# Altium schematic sheet AMS_MCU.SchDoc: MCU
size A4; CheckedBy: Àlex Sánchez i Benet; DrawnBy: Àlex Sánchez i Benet; DocumentNumber: 1; Revision: 1; SheetNumber: 1; SheetTotal: 4; University: UPC EEBE; City: Barcelona; Country: Spain; CP: 08019; Address: Av. Eduard Maristany, 16
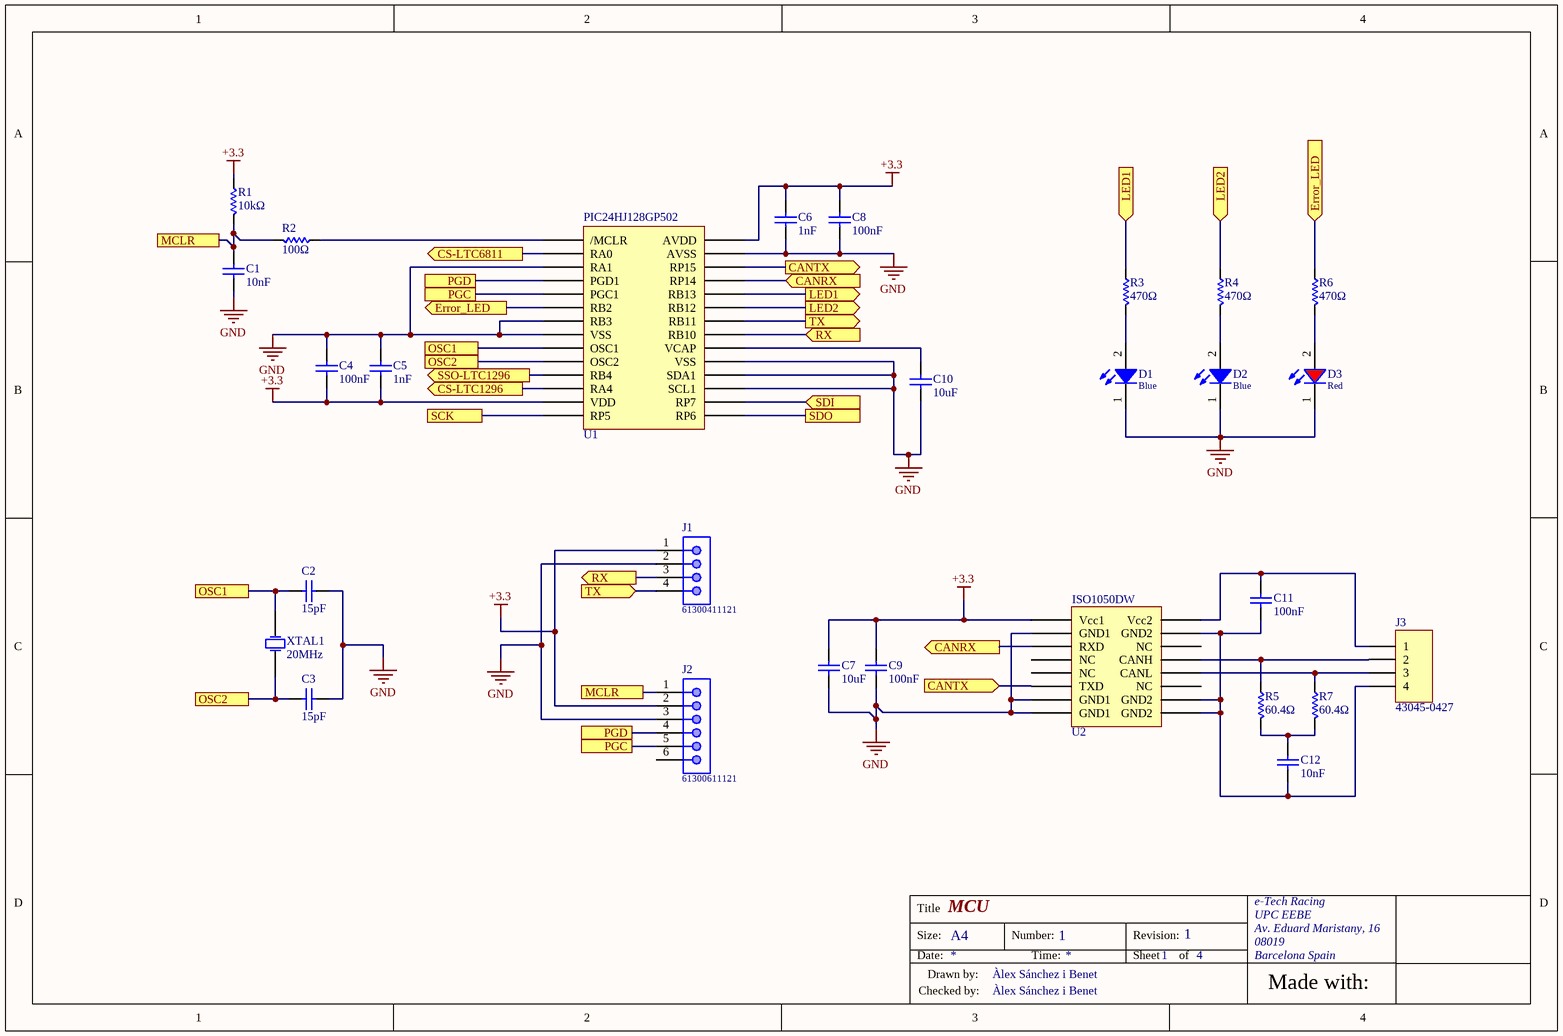
[diagram p0: AMS_MCU.SchDoc]

## Parts
C1  10nF  [0805_2x1.25x0.8mm_Reflow Soldering]
C2  15pF  [0805_2x1.25x0.6mm_Reflow Soldering]
C3  15pF  [0805_2x1.25x0.6mm_Reflow Soldering]
C4  100nF  [0805_2x1.25x0.8mm_Reflow Soldering]
C5  1nF  [0805_2x1.25x0.8mm_Reflow Soldering]
C6  1nF  [0805_2x1.25x0.8mm_Reflow Soldering]
C7  10uF  [0805_2x1.25x1.25mm_Reflow Soldering]
C8  100nF  [0805_2x1.25x0.8mm_Reflow Soldering]
C9  100nF  [0805_2x1.25x0.8mm_Reflow Soldering]
C10  10uF  [0805_2x1.25x1.25mm_Reflow Soldering]
C11  100nF  [0805_2x1.25x0.8mm_Reflow Soldering]
C12  10nF  [0805_2x1.25x0.8mm_Reflow Soldering]
D1  Blue  [WL-SMCW_0805]
D2  Blue  [WL-SMCW_0805]
D3  Red  [WL-SMCW_0805]
J1  61300411121  [61300411121]
J2  61300611121  [61300611121]
J3  43045-0427  [43045-0427]
R1  10kΩ  [CR0805]
R2  100Ω  [CR0805]
R3  470Ω  [CR0805]
R4  470Ω  [CR0805]
R5  60.4Ω  [CR0805]
R6  470Ω  [CR0805]
R7  60.4Ω  [CR0805]
U1  PIC24HJ128GP502  [PIC24HJ128GP502]
U2  ISO1050DW  [ISO1050DW]
XTAL1  20MHz  [830028710]

## Ports
CANRX (in), CANRX (out), CANTX (in), CANTX (out), CS-LTC1296 (out), CS-LTC6811 (out), Error_LED (in), Error_LED (out), LED1 (in), LED1 (out), LED2 (in), LED2 (out), MCLR, OSC1, OSC2, PGC, PGD, RX (in), RX (out), SCK, SDI (in), SDO, SSO-LTC1296 (out), TX (in), TX (out)

## Nets
+3.3: C4.1 C5.1 C6.2 C7.2 C8.2 C9.2 J1.1 J2.2 R1.2 U1.13(VDD) U1.28(AVDD) U2.1(Vcc1)
GND: C1.1 C2.2 C3.2 C4.2 C5.2 C6.1 C7.1 C8.1 C9.1 C10.1 D1.1(K) D2.1(K) D3.1(K) J1.2 J2.3 U1.3(RA1) U1.7(RB3) U1.8(VSS) U1.17(SCL1) U1.18(SDA1) U1.19(VSS) U1.27(AVSS) U2.2(GND1) U2.7(GND1) U2.8(GND1)
CANRX: U1.25(RP14) U2.3(RXD) ; port CANRX
CANTX: U1.26(RP15) U2.6(TXD) ; port CANTX
CS-LTC1296: U1.12(RA4) ; port CS-LTC1296
CS-LTC6811: U1.2(RA0) ; port CS-LTC6811
Error_LED: R6.2 U1.6(RB2) ; port Error_LED
LED1: R3.2 U1.24(RB13) ; port LED1
LED2: R4.2 U1.23(RB12) ; port LED2
MCLR: C1.2 J2.1 R1.1 R2.1 ; port MCLR
OSC1: C2.1 U1.9(OSC1) XTAL1.2(OSC2) ; port OSC1
OSC2: C3.1 U1.10(OSC2) XTAL1.1(OSC1) ; port OSC2
PGC: J2.5 U1.5(PGC1) ; port PGC
PGD: J2.4 U1.4(PGD1) ; port PGD
RX: J1.3 U1.21(RB10) ; port RX
SCK: U1.14(RP5) ; port SCK
SDI: U1.16(RP7) ; port SDI
SDO: U1.15(RP6) ; port SDO
SSO-LTC1296: U1.11(RB4) ; port SSO-LTC1296
TX: J1.4 U1.22(RB11) ; port TX
NetC10_2: C10.2 U1.20(VCAP)
NetC11_1: C11.1 C12.1 J3.4 U2.9(GND2) U2.10(GND2) U2.15(GND2)
NetC11_2: C11.2 J3.1 U2.16(Vcc2)
NetC12_2: C12.2 R5.1 R7.1
NetD1_2: D1.2(A) R3.1
NetD2_2: D2.2(A) R4.1
NetD3_2: D3.2(A) R6.1
NetJ3_2: J3.2 R5.2 U2.13(CANH)
NetJ3_3: J3.3 R7.2 U2.12(CANL)
NetR2_2: R2.2 U1.1(/MCLR)

Not connected (* = marked no-connect by the designer): J2 6; U2 4(NC) 5(NC) 11(NC) 14(NC)

## Notes on the sheet
- Title
- e-Tech Racing
- UPC EEBE
- Size:
- Date:
- Drawn by:
- A4
- Number:
- Time:
- Revision:
- Sheet
- of
- Av. Eduard Maristany, 16
- 08019
- Barcelona Spain
- Made with:
- Checked by:

## Library data of the parts
C1 C12 = 885012207092: WCAP-CSGP Ceramic Capacitors, 0805, X7R, 50V, 10nF; Rated Voltage: 50V DC; ComponentLink1Description: Manufacturer; ComponentLink1URL: http://www.we-online.de; ComponentLink2Description: Datasheet; ComponentLink2URL: http://katalog.we-online.de/pbs/datasheet/885012207092.pdf; Part Number: 885012207092; Publisher: Wurth Elektronik; Size: 0805; Operating Temperature: -55 °C to +125 °C; Value: 10nF; Ceramic Type: X7R
C2 C3 = 885012007052: WCAP-CSGP Ceramic Capacitors, 0805, NP0, 50V, 15pF; Rated Voltage: 50V DC; ComponentLink1Description: Manufacturer; ComponentLink1URL: http://www.we-online.de; ComponentLink2Description: Datasheet; ComponentLink2URL: http://katalog.we-online.de/pbs/datasheet/885012007052.pdf; Part Number: 885012007052; Published Date: Oct. 2017; Publisher: Wurth Elektronik; Size: 0805; Operating Temperature: -55 °C to +125 °C; Value: 15pF; Ceramic Type: NP0
C4 C8 C9 C11 = 885012207098: WCAP-CSGP Ceramic Capacitors, 0805, X7R, 50V, 100nF; Rated Voltage: 50V DC; ComponentLink1Description: Manufacturer; ComponentLink1URL: http://www.we-online.de; ComponentLink2Description: Datasheet; ComponentLink2URL: http://katalog.we-online.de/pbs/datasheet/885012207098.pdf; Part Number: 885012207098; Publisher: Wurth Elektronik; Size: 0805; Operating Temperature: -55 °C to +125 °C; Value: 100nF; Ceramic Type: X7R
C5 C6 = 885012007063: WCAP-CSGP Ceramic Capacitors, 0805, NP0, 50V, 1nF; Rated Voltage: 50V DC; ComponentLink1Description: Manufacturer; ComponentLink1URL: http://www.we-online.de; ComponentLink2Description: Datasheet; ComponentLink2URL: http://katalog.we-online.de/pbs/datasheet/885012007063.pdf; Part Number: 885012007063; Published Date: Oct. 2017; Publisher: Wurth Elektronik; Size: 0805; Operating Temperature: -55 °C to +125 °C; Value: 1nF; Ceramic Type: NP0
C7 C10 = 885012107014: WCAP-CSGP Ceramic Capacitors, 0805, X5R, 16V, 10uF; Rated Voltage: 16V DC; ComponentLink1Description: Manufacturer; ComponentLink1URL: http://www.we-online.de; ComponentLink2Description: Datasheet; ComponentLink2URL: http://katalog.we-online.de/pbs/datasheet/885012107014.pdf; Part Number: 885012107014; Published Date: Oct. 2017; Publisher: Wurth Elektronik; Size: 0805; Operating Temperature: -55 °C to +125 °C; Value: 10uF; Ceramic Type: X5R
D1 D2 = 150080BS75000: SMT Mono-color Chip LED Waterclear WL-SMCW, size 0805, Blue, 3.2 V, 140 deg, 145 mcd; Forward Voltage: 3.2 V; Viewing Angle: 140 deg; Peak Wavelength: 465 nm; Dominant Wavelength: 470 nm; Luminous Intensity: 145 mcd; Chip Technology: InGaN; ComponentLink1Description: Manufacturer; ComponentLink1URL: http://www.we-online.de; ComponentLink2Description: Datasheet; ComponentLink2URL: https://katalog.we-online.de/led/datasheet/150080BS75000.pdf; Part Number: 150080BS75000; Published Date: November 2018; Publisher: Wurth Elektronik; Size: 0805; Operating Temperature: -40 to 85 degC; Emitting Color: Blue; Mounting Technology: SMT; Packaging: Tape and Reel
D3 = 150080RS75000: SMT Mono-color Chip LED Waterclear WL-SMCW, size 0805, Red, 2 V, 140 deg, 150 mcd; Forward Voltage: 2 V; Viewing Angle: 140 deg; Peak Wavelength: 630 nm; Dominant Wavelength: 625 nm; Luminous Intensity: 150 mcd; Chip Technology: AlInGaP; ComponentLink1Description: Manufacturer; ComponentLink1URL: http://www.we-online.de; ComponentLink2Description: Datasheet; ComponentLink2URL: https://katalog.we-online.de/led/datasheet/150080RS75000.pdf; Part Number: 150080RS75000; Published Date: November 2018; Publisher: Wurth Elektronik; Size: 0805; Operating Temperature: -40 to 85 degC; Emitting Color: Red; Mounting Technology: SMT; Packaging: Tape and Reel
J1 = 61300411121: THT Vertical Pin Header WR-PHD, Pitch 2.54 mm, Single Row, 4 pins; Pin Number: 4; Pitch: 2.54 mm; Gender: Male; Rated Current: 3 A; Working Voltage: 250 VAC; Withstanding Voltage: 500 VAC; Contact Resistance: 20 mOhm; ComponentLink1Description: Manufacturer; ComponentLink1URL: http://www.we-online.de; ComponentLink2Description: Datasheet; ComponentLink2URL: https://katalog.we-online.de/em/datasheet/6130xx11121.pdf; Part Number: 61300411121; Published Date: August 2018; Publisher: Wurth Elektronik; Operating Temperature: -40 to 105 degC; Mounting Technology: THT; Packaging: Bag; Row Number: Single; Orientation: Vertical
J2 = 61300611121: THT Vertical Pin Header WR-PHD, Pitch 2.54 mm, Single Row, 6 pins; Pin Number: 6; Pitch: 2.54 mm; Gender: Male; Rated Current: 3 A; Working Voltage: 250 VAC; Withstanding Voltage: 500 VAC; Contact Resistance: 20 mOhm; ComponentLink1Description: Manufacturer; ComponentLink1URL: http://www.we-online.de; ComponentLink2Description: Datasheet; ComponentLink2URL: https://katalog.we-online.de/em/datasheet/6130xx11121.pdf; Part Number: 61300611121; Published Date: August 2018; Publisher: Wurth Elektronik; Operating Temperature: -40 to 105 degC; Mounting Technology: THT; Packaging: Bag; Row Number: Single; Orientation: Vertical
J3 = 43045-0427: Micro-Fit 3.0 Vertical Header, 3.00mm Pitch, Dual Row, 4 Circuits, Black; Manufacturer: Molex; Rated Voltage: 600V DC; Rated Current: 8.5A; Circuits: 4; Operating Temperature: -40° to +105°C; Number of Rows: 2; ComponentLink1Description: Datasheet; ComponentLink1URL: https://www.molex.com/webdocs/datasheets/pdf/en-us/0430450427_PCB_HEADERS.pdf
R1 = CR0805-JW-103ELF: Chip Resistor 0805; Manufacturer: Bourns; ComponentLink1Description: Datasheet; ComponentLink1URL: https://www.bourns.com/docs/product-datasheets/chpreztr.pdf?sfvrsn=566c91f1_11
R2 = CR0805-FX-1000ELF: Chip Resistor 0805; Manufacturer: Bourns; ComponentLink1Description: Datasheet; ComponentLink1URL: https://www.bourns.com/docs/product-datasheets/chpreztr.pdf?sfvrsn=566c91f1_11
R3 R4 R6 = CR0805-FX-4700GLF: Chip Resistor 0805; Manufacturer: Bourns; ComponentLink1Description: Datasheet; ComponentLink1URL: https://www.bourns.com/docs/product-datasheets/chpreztr.pdf?sfvrsn=566c91f1_11
R5 R7 = ERA6AEB60R4V: Chip Resistor 0805; Manufacturer: Panasonic; ComponentLink1Description: Datasheet; ComponentLink1URL: https://www.bourns.com/docs/product-datasheets/chpreztr.pdf?sfvrsn=566c91f1_11
U1 = PIC24HJ128GP502: 16-bit Microcontroller / (up to 128 KB Flash and 8K SRAM) with Advanced Analog; Manufacturer: Microchip; Pins: 28; ComponentLink1Description: Datasheet; ComponentLink1URL: http://ww1.microchip.com/downloads/en/devicedoc/70293g.pdf
U2 = ISO1050DW: Galvanically isolated CAN / transceiver; Manufacturer: Texas Instruments; Pins: 16; ComponentLink1Description: Datasheet; ComponentLink1URL: http://www.ti.com/lit/ds/symlink/iso1050.pdf
XTAL1 = 830028710: Industry standard SMD crystal WE-XTAL Quartz Crystal; Manufacturer: Wurth Elektronik; Model: HC49/4HSMX; ComponentLink1Description: Datasheet; ComponentLink1URL: https://katalog.we-online.com/pbs/datasheet/830028710.pdf; Mounting Technology: SMT; Frequency: 20MHz